# EAGLE design AlienWhoopF0 (EAGLE 9.0.0)
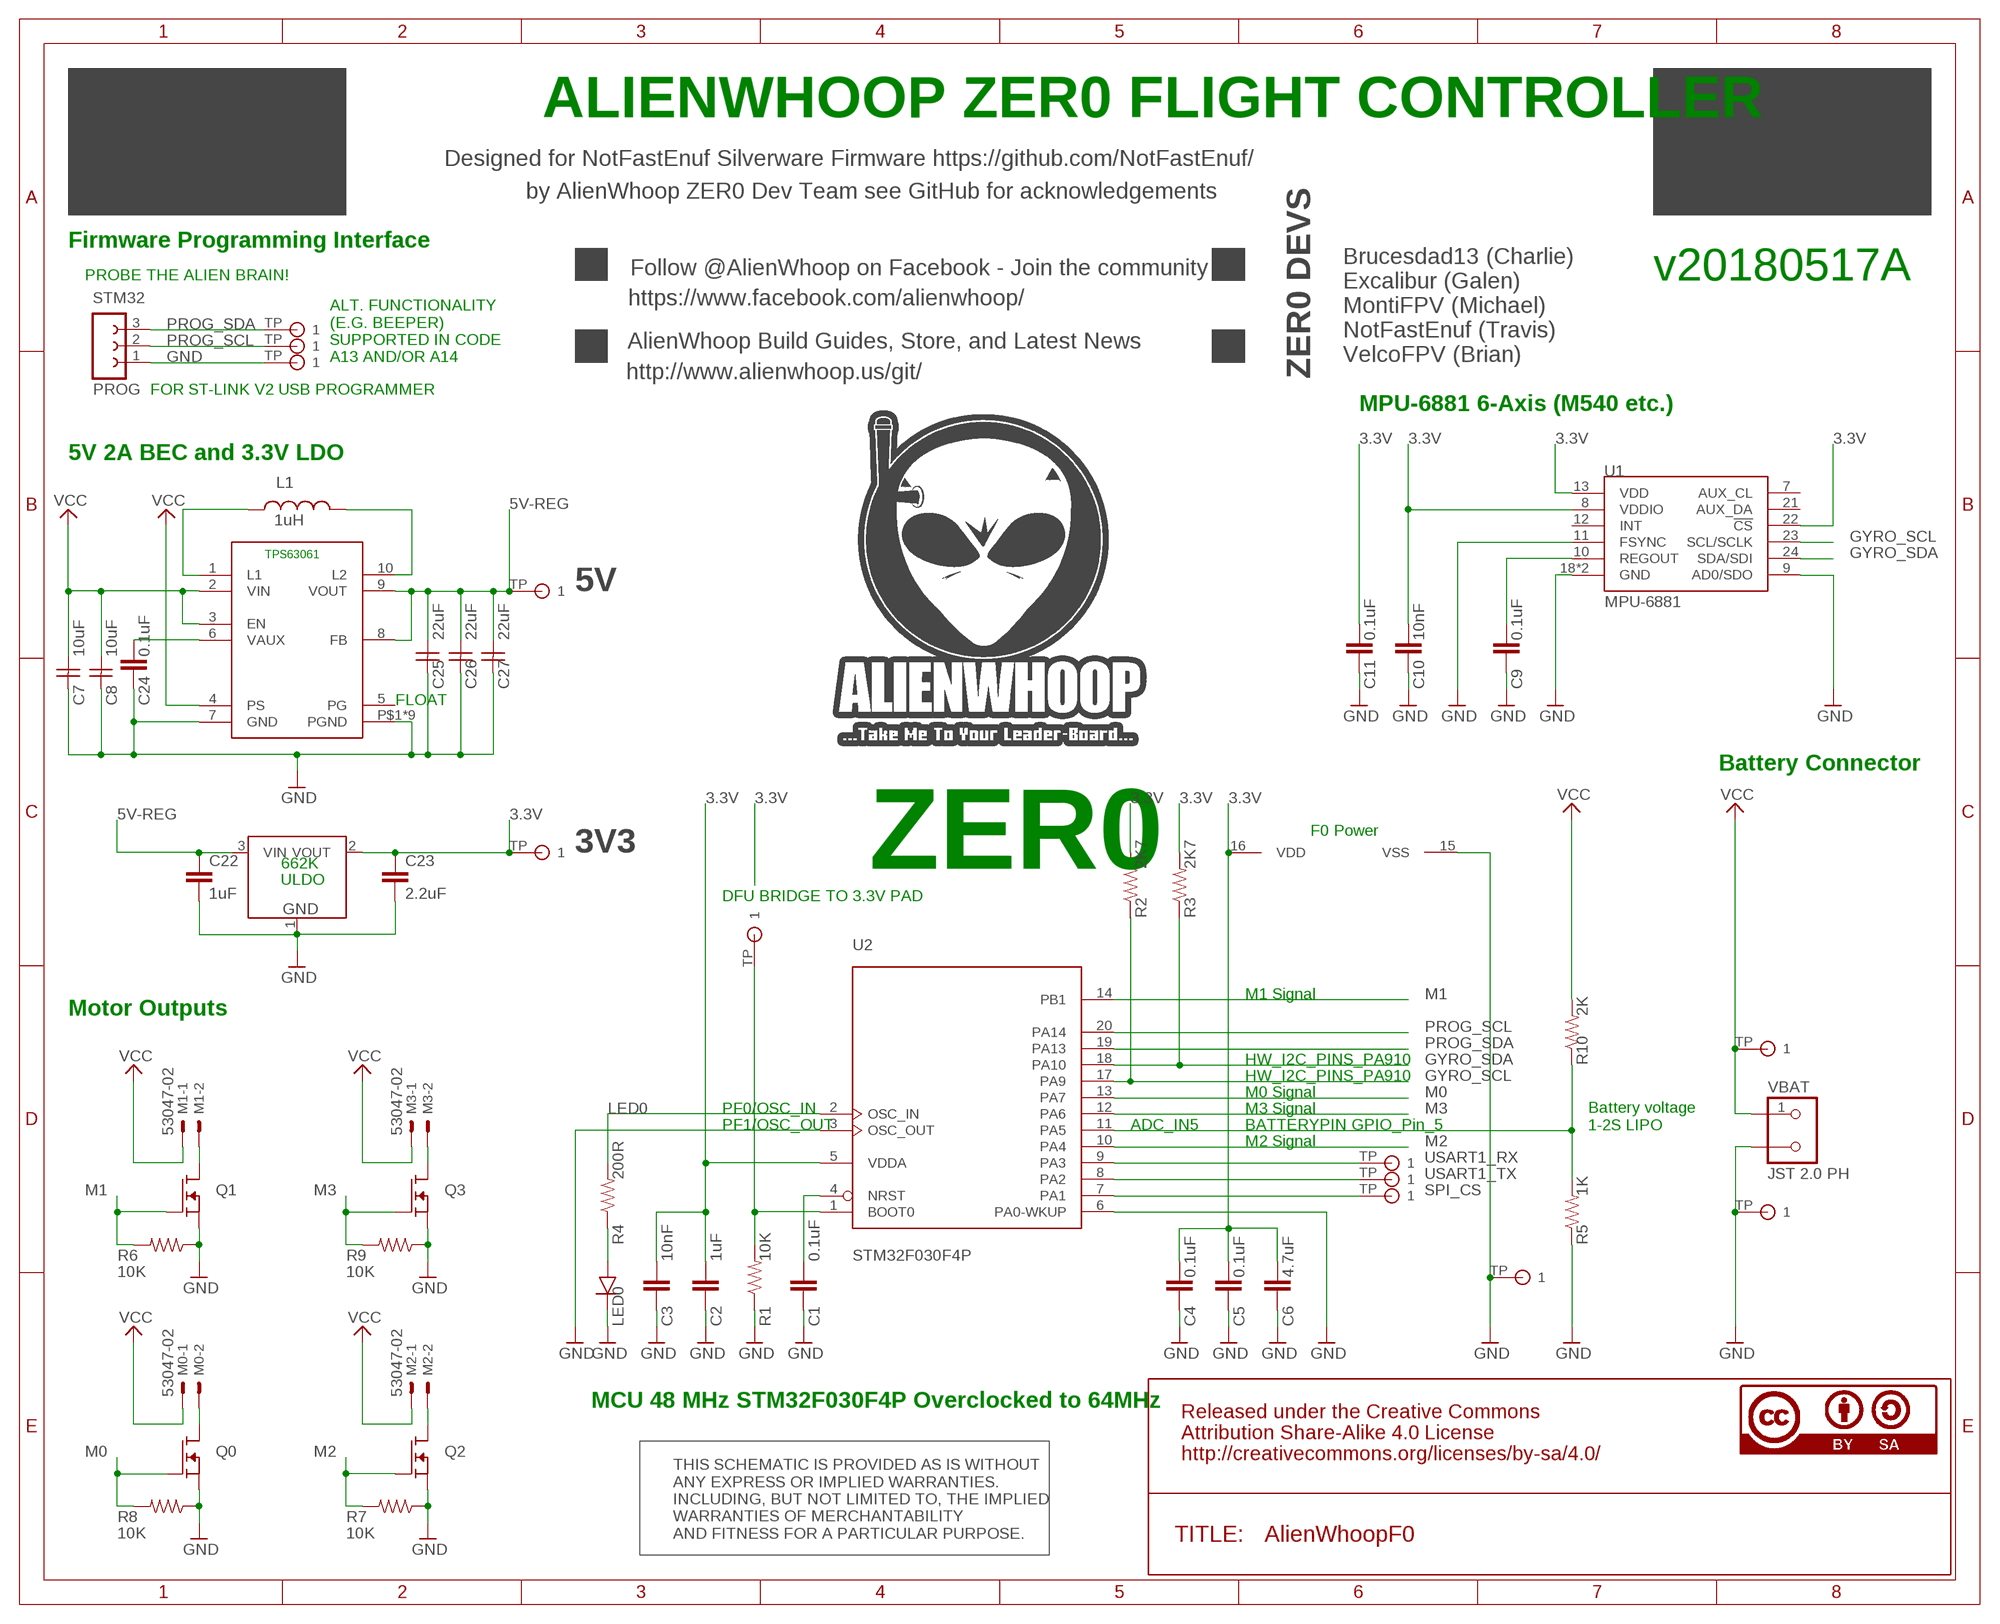
[diagram p0: schematic, sheet 1]

## Parts
3.3V2  TESTPAD  [TESTPAD]
5V2  TESTPAD  [TESTPAD]
+  TESTPAD  [TESTPAD]
-  TESTPAD  [TESTPAD]
A13  TESTPAD  [TESTPAD]
A14  TESTPAD  [TESTPAD]
C1  0.1uF  CAP_0402  [0402]
C2  1uF  CAP_0402  [0402]
C3  10nF  CAP_0402  [0402]
C4  0.1uF  CAP_0402  [0402]
C5  0.1uF  CAP_0402  [0402]
C6  4.7uF  CAP_0402  [0402]
C7  10uF  CAPACITOR10UF  [YUDEN-CAP-0805]
C8  10uF  CAPACITOR10UF  [YUDEN-CAP-0805]
C9  0.1uF  CAP_0402  [0402]
C10  10nF  CAP_0402  [0402]
C11  0.1uF  CAP_0402  [0402]
C22  1uF  CAP_0402  [0402]
C23  2.2uF  CAP_0402  [0402]
C24  0.1uF  CAP_0402  [0402]
C25  22uF  CAPACITOR22UF  [YUDEN-CAP-0805]
C26  22uF  CAPACITOR22UF  [YUDEN-CAP-0805]
C27  22uF  CAPACITOR22UF  [YUDEN-CAP-0805]
DFU  TESTPAD  [TESTPAD]
GND23  TESTPAD  [TESTPAD]
GND@2  TESTPAD  [TESTPAD]
L1  1uH  DFE201612E-INDUCTOR1UH  [DFE201612E-INDUCTOR]
LED0  BLUE  SMD-CHIP-LED-0805  [SMD-CHIP-LED-0805]
M0  53047-02  [53047-02]
M1  53047-02  [53047-02]
M2  53047-02  [53047-02]
M3  53047-02  [53047-02]
Q0  FDMA410NZ  [MICROFET-2X2]
Q1  FDMA410NZ  [MICROFET-2X2]
Q2  FDMA410NZ  [MICROFET-2X2]
Q3  FDMA410NZ  [MICROFET-2X2]
Q5  3.3V  AP2210-ULDO3.3V  [SOT-23]
R1  10K  RES_0402  [0402]
R2  2K7  RES_0402  [0402]
R3  2K7  RES_0402  [0402]
R4  200R  RES_0402  [0402]
R5  1K  RES_0402  [0402]
R6  10K  RES_0402  [0402]
R7  10K  RES_0402  [0402]
R8  10K  RES_0402  [0402]
R9  10K  RES_0402  [0402]
R10  2K  RES_0402  [0402]
SPI_CS  TESTPAD  [TESTPAD]
STM32  PROG  FE03-1  [FE03-1]
U1  MPU-6881  [QFN24_PAD]
U2  STM32F030F4P  [TSSOP20-I]
U7  TPS63061DSC5V  [TPS6306X]
U$13  TESTPAD  [TESTPAD]
U$14  TESTPAD  [TESTPAD]
VBAT  JST 2.0 PH  JST-PH-BAT  [S2B-PH-K-S]

## Nets
3.3V: 3.3V2.TP C2.1 C3.1 C4.1 C5.1 C6.1 C10.1 C11.2 C23.1 Q5.2(VOUT) R2.2 R3.2 U1.8(VDDIO) U1.13(VDD) U1.22(!CS) U2.5(VDDA) U2.16(VDD)
5V-REG: 5V2.TP C22.1 C25.1 C26.1 C27.1 Q5.3(VIN) U7.8(FB) U7.9(VOUT)
BOOT: DFU.TP R1.2 U2.1(BOOT0)
GND: -.TP C1.2 C2.2 C3.2 C4.2 C5.2 C6.2 C7.2 C8.2 C9.2 C10.2 C11.1 C22.2 C23.2 C24.2 C25.2 C26.2 C27.2 GND23.TP GND@2.TP LED0.C Q0.S Q0.S1(S) Q1.S Q1.S1(S) Q2.S Q2.S1(S) Q3.S Q3.S1(S) Q5.1(GND) R1.1 R5.1 R6.1 R7.1 R8.1 R9.1 STM32.1 U1.9(AD0/SDO) U1.11(FSYNC) U1.18(GND) U1.20(GND) U2.3(OSC_OUT) U2.6(PA0-WKUP) U2.15(VSS) U7.7(GND) U7.P$1(PGND) U7.P$2(PGND) U7.P$3(PGND) U7.P$4(PGND) U7.P$5(PGND) U7.P$17(PGND) U7.P$18(PGND) U7.P$21(PGND) U7.P$22(PGND) VBAT.2
GYRO_SCL: R2.1 U1.23(SCL/SCLK) U2.17(PA9)
GYRO_SDA: R3.1 U1.24(SDA/SDI) U2.18(PA10)
L1A: L1.P$1 U7.1(L1)
L1B: L1.P$2 U7.10(L2)
LED: LED0.A R4.1
LED0: R4.2 U2.2(OSC_IN)
M0: Q0.G R8.2 U2.13(PA7)
M0G: M0.2 M0.2S Q0.D Q0.D1(D) Q0.D2(D) Q0.D3(D) Q0.D4(D)
M1: Q1.G R6.2 U2.14(PB1)
M1G: M1.2 M1.2S Q1.D Q1.D1(D) Q1.D2(D) Q1.D3(D) Q1.D4(D)
M2: Q2.G R7.2 U2.10(PA4)
M2G: M2.2 M2.2S Q2.D Q2.D1(D) Q2.D2(D) Q2.D3(D) Q2.D4(D)
M3: Q3.G R9.2 U2.12(PA6)
M3G: M3.2 M3.2S Q3.D Q3.D1(D) Q3.D2(D) Q3.D3(D) Q3.D4(D)
NRST: C1.1 U2.4(NRST)
PROG_SCL: A14.TP STM32.2 U2.20(PA14)
PROG_SDA: A13.TP STM32.3 U2.19(PA13)
REGOUT: C9.1 U1.10(REGOUT)
SPI_CS: SPI_CS.TP U2.7(PA1)
USART1_RX: U2.9(PA3) U$13.TP
USART1_TX: U2.8(PA2) U$14.TP
VAUX: C24.1 U7.6(VAUX)
VCC: +.TP C7.1 C8.1 M0.1 M0.1S M1.1 M1.1S M2.1 M2.1S M3.1 M3.1S R10.2 U7.2(VIN) U7.3(EN) U7.4(PS) VBAT.1
VOLTDIV: R5.2 R10.1 U2.11(PA5)
Unconnected: U1.7(AUX_CL) U1.12(INT) U1.21(AUX_DA) U7.5(PG)

## Notes on the sheet
- ALIENWHOOP ZER0 FLIGHT CONTROLLER
- Designed for NotFastEnuf Silverware Firmware https://github.com/NotFastEnuf/
- by AlienWhoop ZER0 Dev Team see GitHub for acknowledgements
- Firmware Programming Interface
- Follow @AlienWhoop on Facebook - Join the community
- PROBE THE ALIEN BRAIN! | v20180517A
- https://www.facebook.com/alienwhoop/
- AlienWhoop Build Guides, Store, and Latest News
- ALT. FUNCTIONALITY
  (E.G. BEEPER)
  SUPPORTED IN CODE
  A13 AND/OR A14
- Brucesdad13 (Charlie)
  Excalibur (Galen)
  MontiFPV (Michael)
  NotFastEnuf (Travis)
  VelcoFPV (Brian)
- http://www.alienwhoop.us/git/ | ZER0 DEVS
- FOR ST-LINK V2 USB PROGRAMMER
- MPU-6881 6-Axis (M540 etc.)
- 5V 2A BEC and 3.3V LDO
- 5V
- FLOAT
- Battery Connector
- F0 Power
- 3V3
- 662K | ZER0
- DFU BRIDGE TO 3.3V PAD
- M1 Signal
- Motor Outputs
- HW_I2C_PINS_PA910
- HW_I2C_PINS_PA910
- M0 Signal
- PF0/OSC_IN | M3 Signal
- PF1/OSC_OUT | ADC_IN5 | BATTERYPIN GPIO_Pin_5
- Battery voltage
  1-2S LIPO
- M2 Signal
- MCU 48 MHz STM32F030F4P Overclocked to 64MHz
- THIS SCHEMATIC IS PROVIDED AS IS WITHOUT
  ANY EXPRESS OR IMPLIED WARRANTIES.
  INCLUDING, BUT NOT LIMITED TO, THE IMPLIED 
  WARRANTIES OF MERCHANTABILITY
  AND FITNESS FOR A PARTICULAR PURPOSE.

## Library data of the parts
3.3V2 5V2 + - A13 A14 DFU GND23 GND@2 SPI_CS U$13 U$14 = AlienWhoop:TESTPAD: Test pad also can be used for tiny solder pad for signal; BOM: EXCLUDE; DNP: T
C1 C4 C5 C9 C11 C24 = Perfect_0402:CAP_0402: 0402 (1005 Metric) Nick Garner - TeleSense; PARTNO: GCM155R71C104KA55D
C2 C22 = Perfect_0402:CAP_0402: 0402 (1005 Metric) Nick Garner - TeleSense; PARTNO: GRM155C71A105KE11D
C3 C10 = Perfect_0402:CAP_0402: 0402 (1005 Metric) Nick Garner - TeleSense; PARTNO: GCM155R71H103KA55D
C6 = Perfect_0402:CAP_0402: 0402 (1005 Metric) Nick Garner - TeleSense; PARTNO: GRM155R60G475ME47J
C7 C8 = alienflight:CAPACITOR: CAPACITORS Murata Datasheet <http://www.murata.com/~/media/webrenewal/support/library/catalog/products/capacitor/mlcc/c02e.ashx?la=en-us> Taiyo Yuden Datasheet <http://www.mouser.com/ds/2/396/mlcc11_hq_e-541564.pdf> Author: Lance Source: http://alienflight.com License: CC BY SA <creativecommons.org/licenses/by-sa/4.0/>; MF: Taiyo Yuden; MPN: JMK212AB7106KG-T
C23 = Perfect_0402:CAP_0402: 0402 (1005 Metric) Nick Garner - TeleSense; PARTNO: GRM155C70J225KE11D
C25-C27 = alienflight:CAPACITOR: CAPACITORS Murata Datasheet <http://www.murata.com/~/media/webrenewal/support/library/catalog/products/capacitor/mlcc/c02e.ashx?la=en-us> Taiyo Yuden Datasheet <http://www.mouser.com/ds/2/396/mlcc11_hq_e-541564.pdf> Author: Lance Source: http://alienflight.com License: CC BY SA <creativecommons.org/licenses/by-sa/4.0/>; MF: Taiyo Yuden; MPN: JMK212BJ226MG-T
L1 = AlienWhoop:DFE201612E-INDUCTOR: Murata Fixed Inductors 0806 2.2uH 20% 2.4A RDC=0.116ohms; MF: Murata; MPN: DFE201612E-1R0M=P2
LED0 = alienflight:SMD-CHIP-LED-0805: SMD CHIP LED APHCM2012QBC/D-F01 View Datasheet <https://www.kingbrightusa.com/images/catalog/spec/APHCM2012QBC-D-F01.pdf> Author: Lance Source: http://alienflight.com License: CC BY SA <creativecommons.org/licenses/by-sa/4.0/>; MF: Kingbright; MPN: APHCM2012QBC/D-F01
M0 M1-M3 = AlienWhoop:53?-02: CONNECTOR wire to board 1.25 mm (.049 inch) pitch header; MF: MOLEX; MPN: 53047-0210; OC_FARNELL: 9733051; OC_NEWARK: 57H4701
Q0 Q1-Q3 = alienflight:FDMA410NZ: N-Channel MOSFET FDMA410NZ View Datasheet <https://www.fairchildsemi.com/datasheets/FD/FDMA410NZ.pdf> Author: Lance Source: http://alienflight.com License: CC BY SA <creativecommons.org/licenses/by-sa/4.0/>; MF: Fairchild; MPN: FDMA410NZ
Q5 = AlienWhoop:AP2210-ULDO: LDO Voltage Regulators 300mA RF ULDO AP2210 Datasheet <https://www.mouser.com/ds/2/115/AP2210-271459.pdf>; PARTNO: AP2210N-3.3TRG1
R1 R6-R9 = Perfect_0402:RES_0402: 0402 (1005 Metric) Nick Garner - TeleSense; PARTNO: RC0402FR-0710KL
R2 R3 = Perfect_0402:RES_0402: 0402 (1005 Metric) Nick Garner - TeleSense; PARTNO: AC0402JR-072K7L
R4 = Perfect_0402:RES_0402: 0402 (1005 Metric) Nick Garner - TeleSense; PARTNO: RC0402JR-7D200RL
R5 = Perfect_0402:RES_0402: 0402 (1005 Metric) Nick Garner - TeleSense; PARTNO: AT0402BRD071KL
R10 = Perfect_0402:RES_0402: 0402 (1005 Metric) Nick Garner - TeleSense; PARTNO: AT0402BRE072KL
STM32 = AlienWhoop:FE03-1: FEMALE HEADER; BOM: EXCLUDE; DNP: T
U1 = Sparkfun:MPU-6881: 2 – 6, 14 - 17 NC Not internally connected. May be used for PCB trace routing.; PARTNO: MPU-6881
U2 = micro-stm_v2:STM32F030F*P: ARM 32-bit Cortex-M0 CPU 48 MHz maximum frequency 16 Kbytes of Flash memory 4 kbytes of SRAM 15 GPIOs 2.4 to 3.6 V application supply; PARTNO: STM32F030F4P6TR
U7 = AlienWhoop:TPS63061DSC: TPS6306x High Input Voltage, Buck-Boost Converter With 2-A Switch Current; PARTNO: TPS63061DSCR
VBAT = alienflight:JST-PH-BAT: Battery Connector JST- S2B-PH-K-S View Datasheet <http://www.jst-mfg.com/product/pdf/eng/ePH.pdf> Author: Lance Source: http://alienflight.com License: CC BY SA <creativecommons.org/licenses/by-sa/4.0/>; BOM: EXCLUDE; DNP: T; MF: JST; MPN: S2B-PH-K-S

## Board
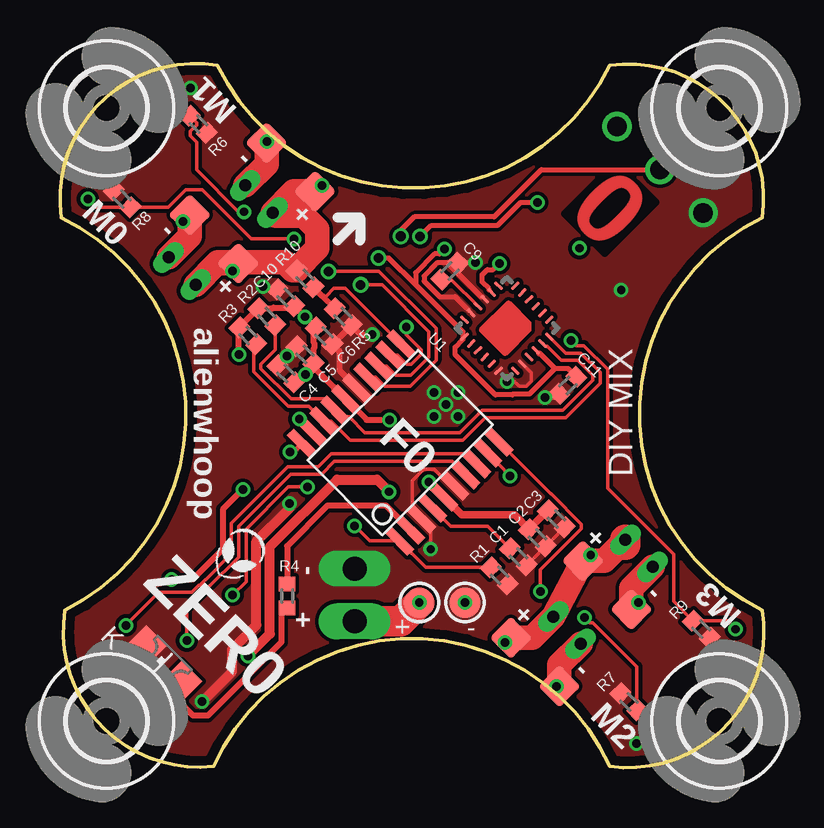
[diagram p1: board, top side]
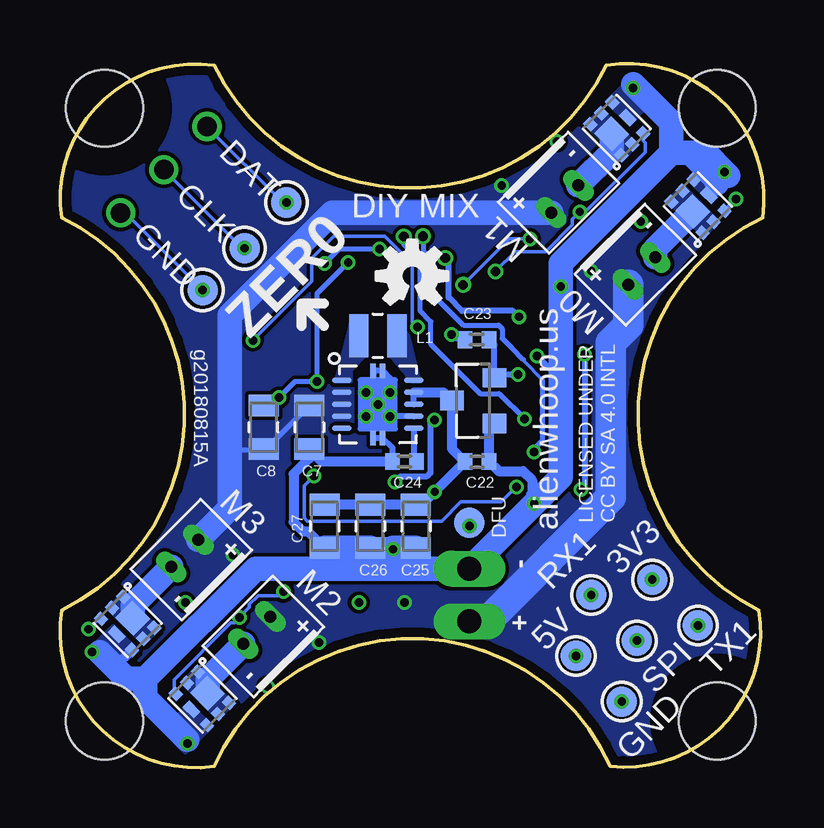
[diagram p2: board, bottom side, seen from below]

Size 29.33 x 29.33 mm. Coordinates in mm from the lower left corner, seen from the top.
Outline: 6.4,0.05 arc-105 0.21,6.56 arc128 0.05,22.91 arc-107 6.56,29.26 arc128 22.91,29.26 arc-106 29.26,22.91 arc128 29.26,6.56 arc-107 22.91,0.05 arc131 6.4,0.05
Copper layers (1*16): Top 0.035559375mm / dielectric 1.6mm / Bottom 0.035559375mm
Design rules "oshpark-2layer *": minimum track width 6mil, minimum drill 10mil, track to track 6mil, track to pad 6mil, pad to pad 6mil, via to via 6mil, smd to smd 6mil, copper to edge 15mil, drill to drill 6mil, minimum pad ring 5mil, minimum via ring 5mil, stop-mask expansion 2.5mil, vias tented up to drill 23mil, thermal gap 10mil

### Footprints (pad centres in the part's own frame; a part is rotated, then mirrored left to right if it is on the bottom)
TESTPAD = smd 1.27 x 1.27: TP 0,0
0402 = smd 0.6 x 0.7: 1 -0.5,0; 2 0.5,0
YUDEN-CAP-0805 = smd 0.9 x 1.25: 1 -0.9,0; 2 0.9,0
DFE201612E-INDUCTOR = smd 0.8 x 1.8: P$1 -0.8,0; P$2 0.8,0
SMD-CHIP-LED-0805 = smd 1.2 x 1.2: A -1.05,0; C 1.05,0
53047-02 = drill 0.5 pad 0.61 long: 1 0.8,0.45; 2 -0.8,0.45 | smd 1.27 x 1.27 bottom: 1S 1.429,-1.429; 2S -1.429,-1.429
MICROFET-2X2 = smd 1 x 1.05: D -0.3,0 | smd 0.4 x 0.47: D1 -0.65,0.915; D2 0,0.915; D3 -0.65,-0.915; D4 0,-0.915; G 0.65,-0.915; S1 0.65,0.915 | smd 0.4 x 0.66: S 0.65,0
SOT-23 = smd 0.802 x 0.972: 1 -0.95,-0.885; 2 0.95,-0.885; 3 0,0.885
FE03-1 = drill 0.813: 1 -5.08,0; 2 -2.54,0; 3 0,0
QFN24_PAD = smd 0.457 x 0.152: 1 -1.5,1; 2 -1.5,0.6; 3 -1.5,0.2; 4 -1.5,-0.2; 5 -1.5,-0.6; 6 -1.5,-1; 13 1.5,-1; 14 1.5,-0.6; 15 1.5,-0.2; 16 1.5,0.2; 17 1.5,0.6; 18 1.5,1 | smd 0.152 x 0.457: 7 -1,-1.5; 8 -0.6,-1.5; 9 -0.2,-1.5; 10 0.2,-1.5; 11 0.6,-1.5; 12 1,-1.5; 19 1,1.5; 20 0.6,1.5; 21 0.2,1.5; 22 -0.2,1.5; 23 -0.6,1.5; 24 -1,1.5
TSSOP20-I = smd 0.4 x 1.35: 1 -2.925,-2.875; 2 -2.275,-2.875; 3 -1.625,-2.875; 4 -0.975,-2.875; 5 -0.325,-2.875; 6 0.325,-2.875; 7 0.975,-2.875; 8 1.625,-2.875; 9 2.275,-2.875; 10 2.925,-2.875; 11 2.925,2.875; 12 2.275,2.875; 13 1.625,2.875; 14 0.975,2.875; 15 0.325,2.875; 16 -0.325,2.875; 17 -0.975,2.875; 18 -1.625,2.875; 19 -2.275,2.875; 20 -2.925,2.875
TPS6306X = smd 0.23 x 0.811: 1 1,1.5; 2 0.5,1.5; 3 0,1.5; 4 -0.5,1.5; 5 -1,1.5; 6 -1,-1.5; 7 -0.5,-1.5; 8 0,-1.5; 9 0.5,-1.5; 10 1,-1.5 | drill 0.35 pad 0.406: P$1 0,0; P$2 -0.5,0.5; P$3 -0.5,-0.5; P$4 0.5,-0.5; P$5 0.5,0.5 | smd 0.6 x 0.23: P$17 1.4,0.2; P$18 1.4,-0.2; P$21 -1.4,0.2; P$22 -1.4,-0.2
3,2 = hole 3.2: 0,0
S2B-PH-K-S = drill 1 long: 1 1.1,0; 2 -1.1,0

### Placement (x,y rotation side)
3.3V2  4.65,7.83 0 bottom
5V2  7.83,4.65 0 bottom
+  14.97,6.87 0 top
-  16.88,6.87 0 top
A13  19.89,23.54 0 bottom
A14  21.64,21.64 0 bottom
C1  19.1,8.78 315 top
C2  19.89,9.57 315 top
C3  20.69,10.37 315 top
C4  9.41,16.4 135 top
C5  10.21,17.19 135 top
C6  11,17.99 315 top
C7  18.94,14.18 270 bottom
C8  20.84,14.18 90 bottom
C9  16.24,20.69 45 top
C10  9.41,19.57 135 top
C11  21.16,15.92 45 top
C22  11.95,12.75 0 bottom
C23  11.95,17.83 180 bottom
C24  14.97,12.75 180 bottom
C25  14.49,10.05 270 bottom
C26  16.4,10.05 270 bottom
C27  18.3,10.05 270 bottom
DFU  12.27,10.21 0 bottom
GND23  5.92,2.75 0 bottom
GND@2  23.38,19.89 0 bottom
L1  16.08,17.99 0 bottom
LED0  4.33,4.33 135 top
LOGO3  OSHW-LOGOS  [OSHW-LOGO-S]  14.65,20.48 0 bottom
M0  5.41,21.01 225 bottom
M1  8.61,24.01 225 bottom
M2  20.81,5.41 45 bottom
M3  23.81,8.61 45 bottom
Q0  2.75,23.38 45 bottom
Q1  6.13,26.61 45 bottom
Q2  23.39,2.88 225 bottom
Q3  26.51,6.01 225 bottom
Q5  12.11,15.29 90 bottom
R1  18.3,7.99 135 top
R2  8.62,18.78 135 top
R3  7.83,17.99 135 top
R4  9.46,7.15 90 top
R5  11.8,18.78 135 top
R6  5.76,26.8 135 top
R7  23.7,2.75 315 top
R8  2.59,23.7 315 top
R9  26.72,5.76 135 top
R10  10.21,20.37 135 top
SPI_CS  5.29,5.29 0 bottom
STM32  23.21,26.71 135 top
U1  18.62,18.3 225 top
U2  14.18,13.54 45 top
U7  16.08,15.13 90 bottom
U$1  [3,2]  1.94,1.94 0 top
U$2  [3,2]  1.94,27.47 0 top
U$3  [3,2]  27.47,27.47 0 top
U$4  [3,2]  27.47,1.94 0 top
U$13  7.19,7.19 0 bottom
U$14  2.75,5.92 0 bottom
VBAT  12.27,7.19 270 bottom

### Tracks (layer width: path | path; a pad name or v marks a point on that pad's centre or on a via)
3.3V  (via drill 0.35, 0.4)
  Top 0.152: U1.22 19.93,17.28 | U1.13 16.85,17.91 16.79,17.84 | U1.8 17.88,19.89
  Top 0.203: C3.1 20.36,10.72 | v16.02,21.6 15.82,21.4 15.6,21.4 14.82,20.62 14.82,20.11 | 14.82,20.11 16.79,18.14 16.79,17.84 16.75,17.84 16.75,17.8 16.46,17.51 16.46,17.21 18.14,15.53 18.85,15.53 18.88,15.55 19.56,15.55 20.64,16.63 | 17.88,19.89 17.88,19.94 17.59,20.23 17.59,20.53 17.81,20.75 18.05,20.75 v18.3,21 | 20.64,16.63 21.16,16.63 C11.2 | 20.64,16.63 20.62,16.63 19.97,17.28 19.93,17.28 19.98,17.23 | 14.82,20.11 13.7,21.23 v13.27,21.23
  Top 0.254: U2.5 15.88,11.38 | 15.88,11.38 15.98,11.38 U2.5 | 15.71,11.55 15.87,11.38 15.88,11.38 | R2.2 R3.2 7.44,18.31 7.44,17.48 7.47,17.46 v7.47,17.21 | C4.1 9.91,16.05 v10.24,16.37 10.56,16.7 | R2.2 8.35,19.22 | R2.2 8.86,19.13 8.89,19.17 9.71,19.17 C10.1 v10.21,18.78 C6.1 10.56,18.25 10.56,17.73 10.59,17.7 10.59,17.47 10.56,17.43 C5.1 10.56,16.7 | v15.37,11.89 U2.5 | U2.5 | v13.72,14.48 12.78,14.48 U2.16 10.56,16.7 | v7.62,11.59 6.79,10.75 6.79,9.1 5.52,7.83 3.3V2.TP
  Top 0.305: U2.5 16.73,10.53 18.94,10.53 C2.1 C3.1 | U2.16 11.45,15.81
  Bottom 0.203: v16.02,21.6 17.71,21.6 v18.3,21
  Bottom 0.254: C23.1 11.23,17.6 Q5.2 11.09,16.37 v10.24,16.37 | v15.37,11.89 15.14,12.12 14.05,12.12 13.89,12.28 13.89,14.31 v13.72,14.48 | v7.47,17.21 7.47,11.74 v7.62,11.59 | v10.21,18.78 10.46,19.03 12.58,19.03 13.13,19.59 13.13,21.09 v13.27,21.23
  other vias: 4.65,7.83
5V-REG  (via drill 0.35)
  Top 0.406: 5V2.TP 8.74,5.57 8.74,9.19 11.54,11.99 13.21,11.99 v13.71,11.49
  Bottom 0.254: U7.8 U7.9 14.21,15.63
  Bottom 0.406: U7.9 13.34,15.63 Q5.3 13,13.29 C22.1 v13.71,11.49 14.25,10.95 C25.1 C26.1 C27.1
  other vias: 7.83,4.65
BOOT  (via drill 0.35)
  Top 0.152: 14.64,8.94 U2.1 | U2.1 15.24,8.34 R1.2 | v12.27,10.07 12.9,9.44 U2.1
  Bottom 0.152: DFU.TP v12.27,10.07
GND  (via drill 0.35)
  Top 0.152: C3.2 C2.2 C1.2 | C4.2 v9.46,17.15 | v18.62,16.08 18.94,16.08 19.14,15.89 19.42,15.89 19.63,16.09 19.63,16.45 U1.20 | U2.6 16.27,11.74 15.59,12.42 15.15,12.42 14.67,11.95 14.67,10.7 14.65,10.68 14.98,10.36 U2.3 15.45,9.97 15.45,9.47 v15.45,9.1
  Top 0.203: 17.6,19.61 17.55,19.61 16.12,21.05 15.75,21.05 15.17,20.47 15.17,20.26 15.82,19.62 16.46,19.62 17.03,19.05 | C11.1 20.65,15.41 v20.21,15.41 | 18.51,16.08 v18.62,16.08 | C9.2 v17.32,21.05
  Top 0.254: R5.1 12.24,18.43 | 12.37,15.82 11.64,16.56 11.64,17.35 C6.2 R5.1 | R5.1 12.54,18.04 v13.01,18.04 | C10.2 8.58,19.93 v8.46,20.05
  Top 0.406: GND23.TP 7.17,3.99 7.17,4.92 8.18,5.94 8.18,9.42 9.57,10.81 v9.57,11
  Bottom 0.152: GND@2.TP 26.61,23.11 STM32.1 | v13.01,18.04 12.8,17.83 C23.2 | v15.45,9.1 15.45,8.45 15.61,8.29 | 1.95,24.5 2.29,24.16 Q0.S
  Bottom 0.203: C8.2 20.54,15.08 v20.21,15.41 19.54,16.08 v18.62,16.08 18.62,19.74 v17.32,21.05
  Bottom 0.254: v9.46,17.15 8.55,16.24 8.46,16.24 | U7.7 U7.P$3 15.88,14.33 U7.P$22 | C24.2 15.47,13.32 U7.P$22 | U7.P$22 U7.P$21 | U7.P$4 15.58,16.23 U7.P$18 U7.P$17 16.28,15.93 U7.P$5 U7.P$2 | 2.43,25.61 2.43,25 | 2.43,23.99 Q0.S
  Bottom 0.406: Q3.S1 27.04,4.19 27.04,4.18 | 27.54,4.94 27.67,4.94 | 11.45,14.11 Q5.1 arc-90 11.45,14.11 | C24.2 18.41,12.75 C7.2 18.94,12.88 19.59,12.23 19.59,10.23 19.2,9.84 18.99,9.84 C27.2 | 11.45,14.11 C22.2 11.06,12.35 10.04,12.35 9.66,11.96 9.66,11.42 9.7,11.37 9.7,11 v9.57,11
  Bottom 1.016: 3.86,25.61 3.86,26.88 5.45,28.46 | 3.86,25.61 8.46,21 v8.46,20.05 8.46,16.24 8.46,12.1 v9.57,11 VBAT.2 15.61,8.29 21.17,8.29 25.77,3.7 | 3.86,25.61 3.06,25.61 | 3.06,25.61 2.43,25.61 v1.64,24.81 1.48,24.65 | 25.77,3.7 25.77,2.91 24.02,1.16 | 25.77,3.7 26.56,3.7 27.04,4.18 27.67,4.81 | 1.95,24.5 3.06,25.61 | 1.95,24.5 1.95,24.34 | C25.2 15.45,9.15 v15.45,9.1 16.4,9.1 C26.2 C27.2 | 1.95,24.5 | 1.95,24.5
  other vias: 5.92,2.75 23.38,19.89 16.88,6.87 24.02,1 5.45,28.31 27.99,4.81
  pour Top (rank 2, no thermals): -4.87,35.77 -4.87,-4.87 35.77,-4.87 35.77,35.77
  pour Bottom (no thermals): 22.99,1.71 23.94,2.67 25.05,1.56 24.1,0.6
  pour Bottom (no thermals): 26.08,4.89 27.19,3.78 28.23,4.81 27.11,5.92
  pour Bottom (no thermals): 6.56,27.75 5.45,28.86 4.49,27.91 5.6,26.8
  pour Bottom (no thermals): 2.19,23.54 3.14,24.5 1.95,25.69 1.16,24.57
GYRO_SCL
  Top 0.152: R2.1 8.97,17.41 8.37,16.81 8.37,16.62 9.64,15.36 10.98,15.36 U2.17 11.45,14.73 11.61,14.73 11.61,14.61 12.04,14.61 12.7,13.95 16.65,13.95 17.58,14.88 20.94,14.88 22.2,16.15 22.2,16.34 21.57,16.96 20.89,16.96 20.29,17.56 20.21,17.56 U1.23
GYRO_SDA
  Top 0.152: R3.1 8.07,17.52 8.07,16.5 9.51,15.05 10.37,15.05 U2.18 11.31,14.43 12.09,13.65 16.78,13.65 17.71,14.58 21.06,14.58 22.51,16.02 22.51,16.46 21.7,17.27 21.07,17.27 U1.24
L1A
  pour Bottom (no thermals): 16.56,18.62 16.56,17.19 17.19,16.56 17.19,16.08 17.83,16.08 17.19,18.62
L1B
  pour Bottom (no thermals): 14.65,16.08 14.34,16.08 14.97,18.62 15.61,18.62 15.61,17.19
LED
  Top 0.254: R4.1 9.22,6.41 9.22,5.23 6.17,2.18 6.16,2.17 5.55,2.17 4.97,2.75 4.97,3.48 LED0.A
LED0
  Top 0.254: U2.2 13.59,10.91 11.14,10.91 9.46,9.23 R4.2
M0  (via drill 0.35, 0.4)
  Top 0.152: U2.13 13.61,16.72 13.99,16.34 14.61,16.34 15.36,17.09 15.36,18.17 13.42,20.11 v12.53,20.11 | v9.75,22.02 7.97,22.02 5.92,24.07 5.23,24.07 4.51,23.35 R8.2 1.5,23.35 v1.16,23.69
  Bottom 0.152: Q0.G 1.64,23.21 v1.16,23.69 | v9.75,22.02 10.62,22.02 v12.53,20.11
M0G  (via drill 0.35)
  Top 0.203: M0.2S v5.13,22.75
  Top 1.016: M0.2S 5.41,22.14 M0.2
  Bottom 1.016: Q0.D 4.52,21.61 M0.2
  pour Bottom (no thermals): 1.87,22.75 3.38,24.26 4.02,23.62 2.51,22.11
M1  (via drill 0.35, 0.4)
  Top 0.152: 15.67,18.15 15.67,16.96 14.59,15.88 13.53,15.88 13.15,16.26 U2.14 | v7.67,23.16 7.71,23.11 7.47,23.11 5.69,24.9 5.69,26.05 5.43,26.31 5.43,26.5 5.69,26.76 5.69,26.87 R6.2 5.59,27.21 | 15.67,18.15 | 15.67,18.15 15.67,18.29 13.29,20.67 v11.18,20.67
  Bottom 0.152: v11.18,20.67 10.36,21.49 9.09,21.49 7.98,22.61 7.98,22.84 v7.67,23.16 7.43,23.16 4.95,25.64 4.95,26.04 5.02,26.11 Q1.G
M1G  (via drill 0.35)
  Top 0.203: M1.2S 8.62,26.04 v8.62,26.08
  Top 1.016: M1.2 8.61,25.14 M1.2S
  Bottom 1.016: Q1.D 6.34,25.64 M1.2
  pour Bottom (no thermals): 5.29,25.92 6.79,27.43 7.43,26.8 5.92,25.29
M2  (via drill 0.35)
  Top 0.152: U2.10 20.45,11.41 20.46,11.41 21.73,10.14 21.73,9.95 20.02,8.25 v20.02,7.33 | v21.85,6.26 22.07,6.03 22.21,6.03 24.04,4.2 24.04,2.41 R7.2
  Bottom 0.152: v20.02,7.33 20.19,7.16 21.08,7.16 21.43,6.81 21.43,6.67 v21.85,6.26 22.07,6.03 22.21,6.03 24.57,3.66 24.57,3.15 Q2.G
M2G  (via drill 0.35)
  Top 0.152: M2.2S v20.69,3.38
  Top 1.016: M2.2 20.81,4.28 M2.2S
  Bottom 1.016: Q2.D 23.18,3.67 M2.2
  pour Bottom (no thermals): 22.75,2.03 24.26,3.54 23.62,4.18 22.11,2.67
M3  (via drill 0.35)
  Top 0.152: v28.15,5.76 27.91,6 27.79,6.12 R9.2 25.56,6.92 25.56,8.88 22.81,11.63 22.81,16.59 21.83,17.57 21.52,17.57 v21.29,17.8 | U2.12 14.07,17.18 14.45,16.8 14.64,16.8 15.06,17.21 15.06,17.4 14.43,18.03 v14.43,18.35
  Bottom 0.152: v21.29,17.8 18.83,20.26 18.83,21.22 17.93,22.13 15.8,22.13 14.65,20.99 14.65,18.58 v14.43,18.35 | Q3.G 27.71,6.2 v28.15,5.76
M3G  (via drill 0.35)
  Top 0.203: M3.2S v24.09,6.87 v24.1,6.87
  Top 1.016: M3.2S 23.81,7.48 M3.2
  Bottom 1.016: Q3.D 26.3,6.75 M3.2
  pour Bottom (no thermals): 25.84,5.13 27.35,6.64 26.72,7.27 25.21,5.76
NRST
  Top 0.152: 15.94,10.4 U2.4 16.29,10.05 17.83,10.05 C1.1
PROG_SCL  (via drill 0.35, 0.4)
  Top 0.203: STM32.2 20.05,24.91 18.09,22.95 14.77,22.95 14.2,22.38 v14.2,22.14 | 10.37,13.21 U2.20 9.71,13.14 v9.58,13.14
  Bottom 0.152: STM32.2 21.73,21.64 A14.TP | 9.22,16.13 9.22,16.16 9.99,16.93 9.99,16.97 10.49,17.47
  Bottom 0.203: 9.22,16.13 9.22,13.62 9.58,13.26 v9.58,13.14 | 10.01,17 10.49,17.47 10.9,17.88 10.9,18.28 11.05,18.43 12.52,18.43 13.35,19.26 13.52,19.43 13.97,19.88 13.97,21.27 14.2,21.5 v14.2,22.14
  other vias: 21.64,21.64
PROG_SDA  (via drill 0.35, 0.4)
  Top 0.203: U2.19 9.98,14.52 v9.97,14.52 | A13.TP 19.19,23.54 18.49,22.84 18.24,22.59 15.47,22.59 v15,22.12
  Bottom 0.152: STM32.3 20.04,23.54 A13.TP
  Bottom 0.203: v9.97,14.52 11.03,15.58 11.82,15.58 13.87,17.63 13.87,18.58 14.32,19.03 14.32,21.12 15,21.8 v15,22.12
  other vias: 19.89,23.54
REGOUT
  Top 0.152: C9.1 16.31,20.33 U1.10
SPI_CS  (via drill 0.35)
  Top 0.152: U2.7 16.34,12.76 11.44,12.76 10.9,12.22 9.61,12.22 7.45,10.06 7.45,8.78 7.45,8.77 6.2,7.52 6.19,7.52 5.29,6.62 SPI_CS.TP
  other vias: 5.29,5.29
USART1_RX  (via drill 0.35)
  Top 0.152: U$13.TP 7.75,7.75 7.75,9.93 9.51,11.69 v10.31,11.69 | U2.9 v18.74,12.15
  Bottom 0.152: v18.74,12.15 19.16,11.74 19.16,10.4 19.02,10.27 13.43,10.27 12.63,11.07 10.93,11.07 v10.31,11.69
  other vias: 7.19,7.19
USART1_TX  (via drill 0.35)
  Top 0.152: U2.8 17.03,12.98 17.03,13.07 11.31,13.07 10.77,12.53 9.49,12.53 7.14,10.18 7.14,8.9 6.07,7.83 6.06,7.83 5.83,7.6 5.79,7.6 5.49,7.3 4.12,7.3 U$14.TP
  other vias: 2.75,5.92
VAUX
  Bottom 0.254: U7.6 14.58,12.86 C24.1
VCC  (via drill 0.35)
  Top 1.016: 12.9,6.24 VBAT.1 | M2.1S 19.68,5.41 M2.1 M3.1S 22.68,8.61 M3.1 | M1.1S 9.74,24.01 M1.1 8.99,22.99 10.15,22.99 10.72,22.42 10.72,21.63 9.85,20.76 R10.2 9.7,20.72 9.37,21.05 6.58,21.05 6.54,21.01 | M0.1S 6.54,21.01 | 6.54,21.01 M0.1
  Top 1.27: 23.56,9.29 M3.1 | VBAT.1 14.19,6.09 +.TP
  Bottom 0.203: C7.1 20.74,13.28 C8.1 20.9,13.22 22.25,13.22
  Bottom 1.016: M3.1 22.25,10.8 22.25,13.22 22.25,18.85 17.98,23.12 M1.1
  Bottom 1.27: M0.1 5.65,18.43 6.38,17.7 6.38,11.26 11.43,6.21 12.25,6.21
  other vias: 14.97,6.87 7.19,20.69 10.92,24.26 22.11,8.86 18.54,5.21
  pour Bottom (rank 2, no thermals): -9.95,40.85 -9.95,-9.95 40.85,-9.95 40.85,40.85
VOLTDIV
  Top 0.152: U2.11 14.5,17.35 14.65,17.35 | 14.2,17.64 U2.11 | U2.11 13.28,18.57 13.28,18.58 11.89,19.96 11.41,19.96 11.09,19.64 10.93,19.64
  Top 0.254: R10.1 10.93,19.64 R5.2

### Text on the board
Top: 0
tPlace: M1 | M0 | alienwhoop | F0 | DIY MIX | ZER0 | M3 | K | + | - | M2
bPlace: DAT | CLK | DIY MIX | GND | M1 | M0 | ZER0 | g20180815A | M3 | LICENSED UNDER / CC BY SA 4.0 INTL | alienwhoop.us | 3V3 | RX1 | M2 | 5V | TX1 | SPI | GND
tStop: 0
Reference: M1 | M0 | M3 | M2